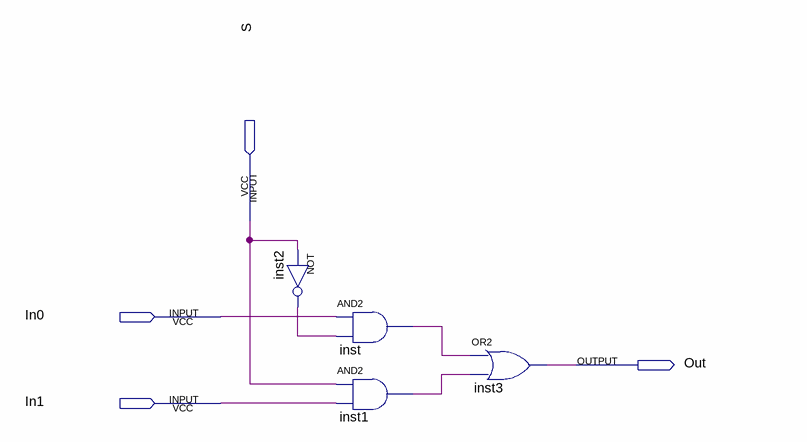
[diagram p0: schematic sheet]
// Quartus schematic Mux2to1.bdf as structural Verilog: 4 symbols, 4 pins
module Mux2to1 (
  input  S,
  input  In0,
  input  In1,
  output Out
);

  wire inst1_out, inst2_out, inst_out;

  not inst2 (inst2_out, S);
  and inst (inst_out, In0, inst2_out);
  and inst1 (inst1_out, S, In1);
  or inst3 (Out, inst_out, inst1_out);
endmodule
